# EAGLE board GD32F450 (EAGLE 9.6.2)
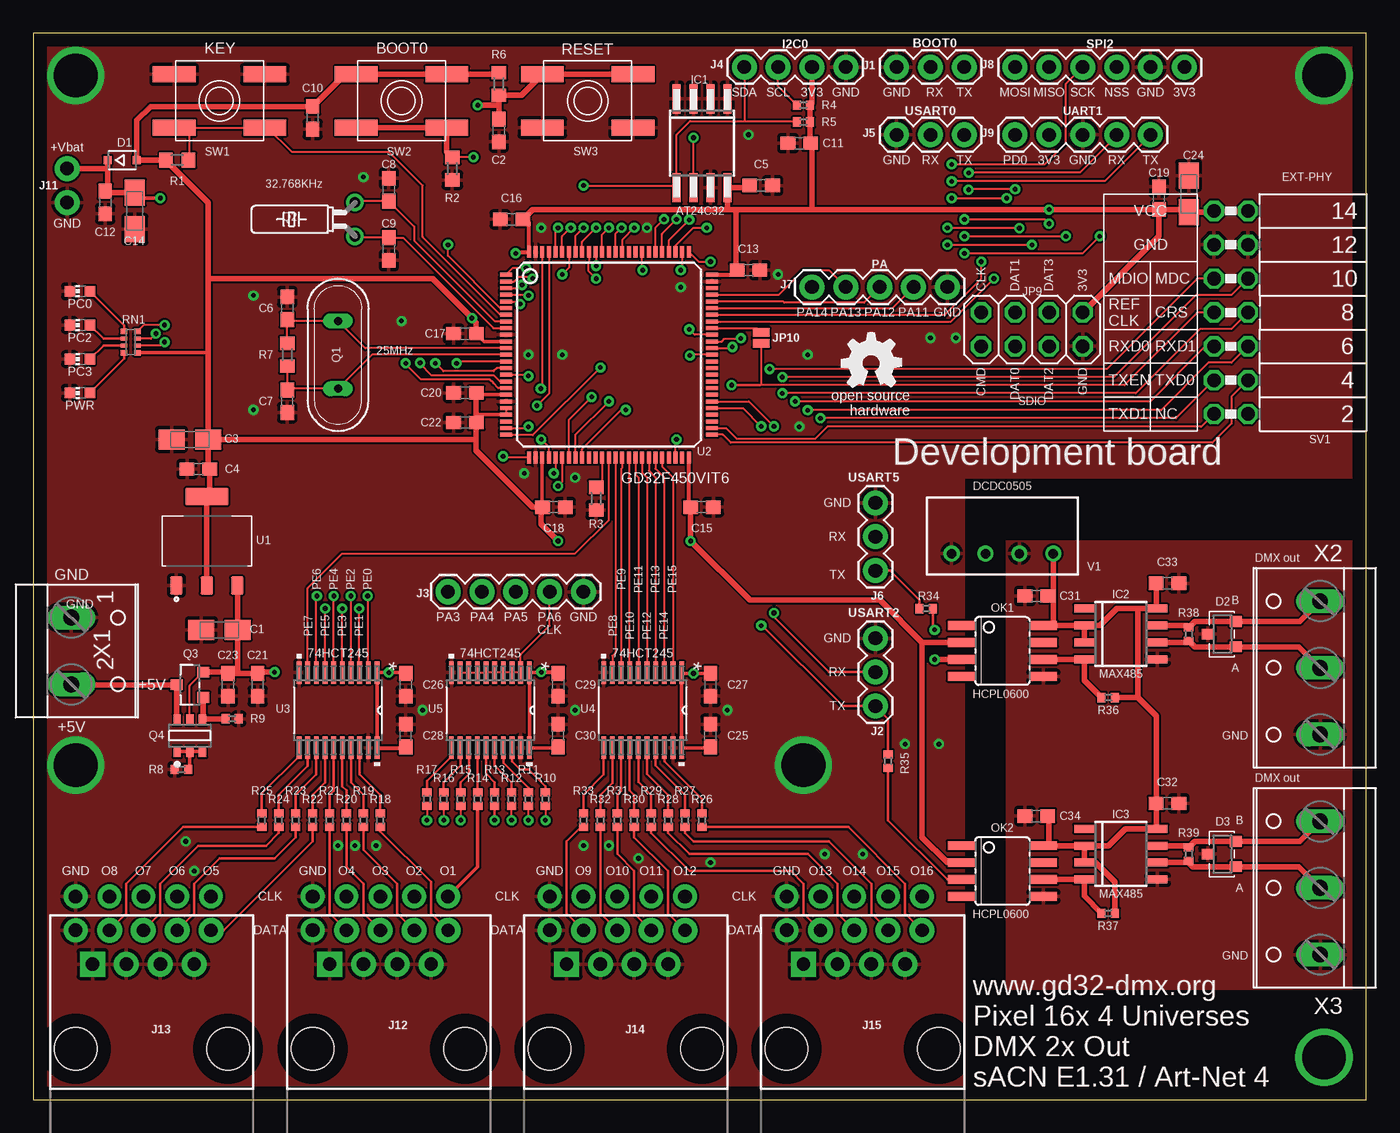
[diagram p2: board, top side]
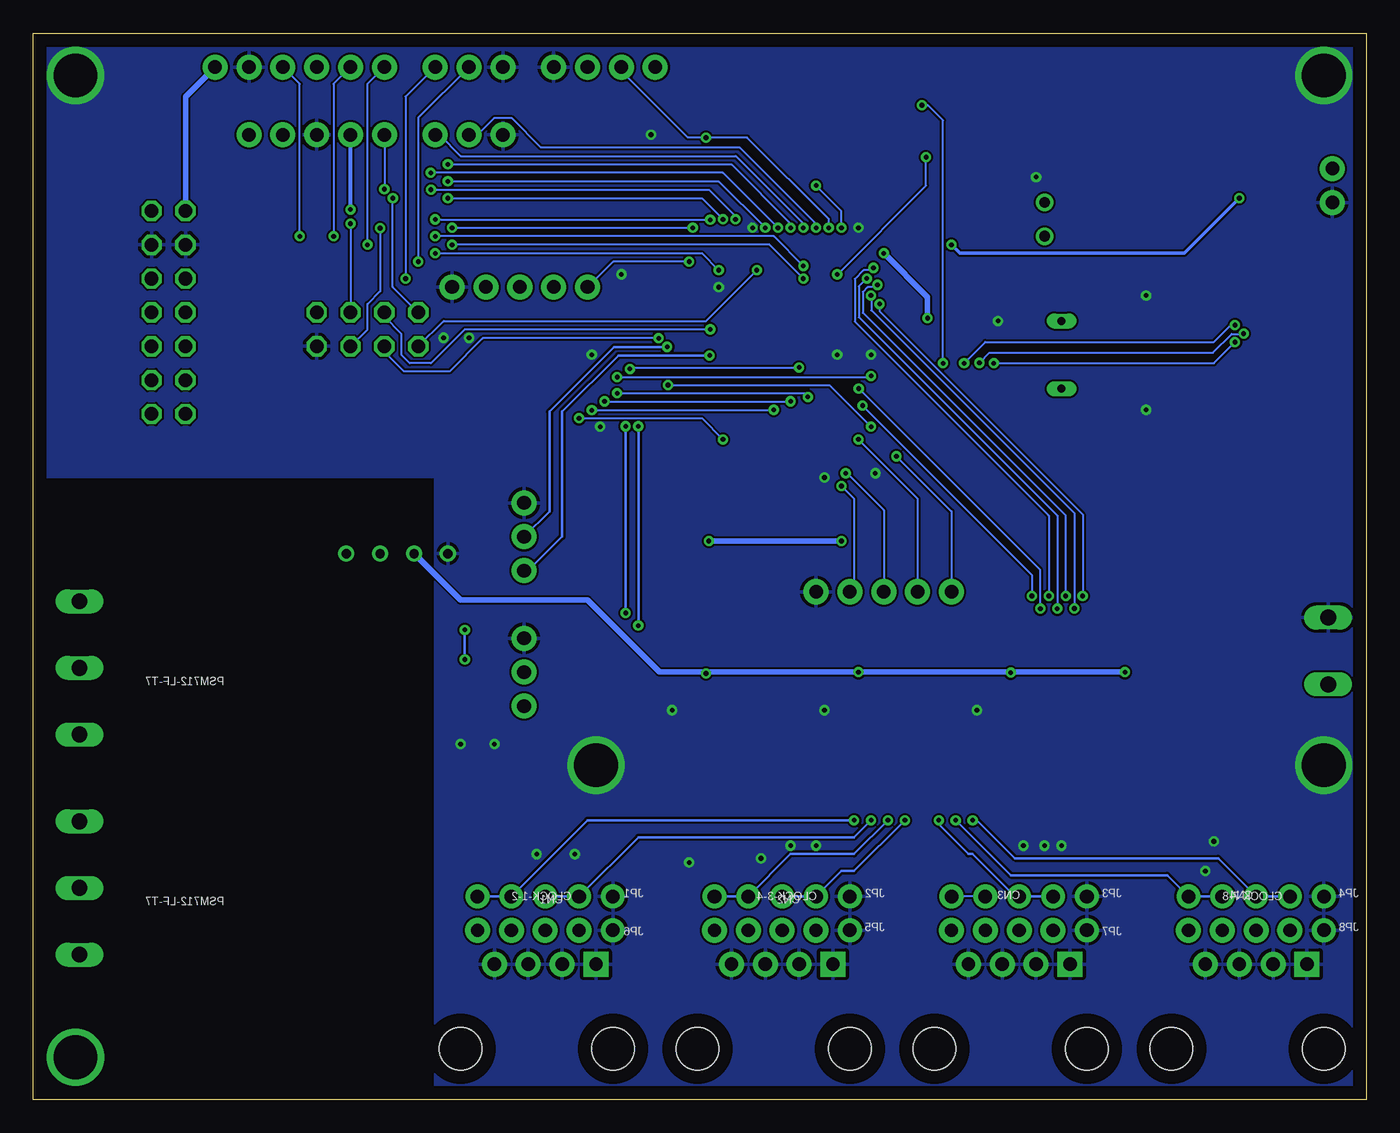
[diagram p3: board, bottom side, seen from below]

Size 100 x 80 mm. Coordinates in mm from the lower left corner, seen from the top.
Outline: 0,0 100,0 100,80 0,80 0,0
Copper layers (1*16): Top 0.035mm / dielectric 1.5mm / Bottom 0.035mm
Design rules "default": minimum track width 6mil, minimum drill 0.35mm, track to track 6mil, track to pad 6mil, pad to pad 6mil, via to via 6mil, smd to smd 6mil, copper to edge 40mil, drill to drill 6mil, minimum pad ring 10mil, minimum via ring 8mil, stop-mask expansion 4mil, vias tented up to drill 0mil, thermal gap 10mil

## Footprints (pad centres in the part's own frame; a part is rotated, then mirrored left to right if it is on the bottom)
A/3216-18R = smd 1.95 x 1.5: + 1.375,0; - -1.375,0
C0603 = smd 1.1 x 1: 1 -0.85,0; 2 0.85,0
1X04-CLEANBIG = drill 1.016 pad 1.778: 1 -3.81,0; 2 -1.27,0; 3 1.27,0; 4 3.81,0
SOD323-R = smd 0.6 x 0.6: A 1.1,0; C -1.1,0
SOT23-3 = smd 0.8 x 0.9: 1 -0.95,-1; 2 0.95,-1; 3 0,1.1
SO-08M = smd 0.6 x 2.2: 1 -1.905,-3.33; 2 -0.635,-3.33; 3 0.635,-3.33; 4 1.905,-3.33; 5 1.905,3.33; 6 0.635,3.33; 7 -0.635,3.33; 8 -1.905,3.33
D_R-PDSO-G8 = smd 0.6 x 1.5: 1 -1.905,-2.75; 2 -0.635,-2.75; 3 0.635,-2.75; 4 1.905,-2.75; 5 1.905,2.75; 6 0.635,2.75; 7 -0.635,2.75; 8 -1.905,2.75
1X03 = drill 1.016 pad 1.88: 1 0,0; 2 2.54,0; 3 5.08,0
1X05 = drill 1.016 pad 1.88: 1 0,0; 2 2.54,0; 3 5.08,0; 4 7.62,0; 5 10.16,0
1X04 = drill 1.016 pad 1.88: 1 0,0; 2 2.54,0; 3 5.08,0; 4 7.62,0
1X06 = drill 1.016 pad 1.88: 1 0,0; 2 2.54,0; 3 5.08,0; 4 7.62,0; 5 10.16,0; 6 12.7,0
1X02_NO_SILK = drill 1.016 pad 1.88: 1 0,0; 2 2.54,0
RJ45-8 = drill 1 pad 1.88 square: 1 -4.445,6.35 | drill 1 pad 1.88: 2 -3.175,8.89; 3 -1.905,6.35; 4 -0.635,8.89; 5 0.635,6.35; 6 1.905,8.89; 7 3.175,6.35; 8 4.445,8.89 | hole 3.2: -5.715,0; 5.715,0
1X01-CLEANBIG = drill 1.016 pad 1.778: 1 0,0
2X04 = drill 1.016 octagon: 1 -3.81,-1.27; 2 -3.81,1.27; 3 -1.27,-1.27; 4 -1.27,1.27; 5 1.27,-1.27; 6 1.27,1.27; 7 3.81,-1.27; 8 3.81,1.27
SMT-JUMPER_2_NO_NO-SILK = smd 0.635 x 1.27: 1 -0.406,0; 2 0.406,0
CHIP-LED0603 = smd 0.8 x 0.8: A 0,-0.75; C 0,0.75
SOIC08 = smd 0.66 x 2.032: 1 -1.905,-3.073; 2 -0.635,-3.073; 3 0.635,-3.073; 4 1.905,-3.073; 5 1.905,3.073; 6 0.635,3.073; 7 -0.635,3.073; 8 -1.905,3.073
QS = drill 0.61 long: 1 -2.54,0; 2 2.54,0
TC26H = drill 0.813: 1 -1.27,0; 2 1.27,0
DIODES_INC._DMG2305UX-13_0 = smd 0.9 x 0.8: 1 -1,0.95; 2 -1,-0.95; 3 1,0
DIODES_DMMT5401-7-F_0 = smd 0.8 x 0.55: 1 -1.2,0.95; 2 -1.2,0; 3 -1.2,-0.95; 4 1.2,-0.95; 5 1.2,0; 6 1.2,0.95
R0603 = smd 1 x 1.1: 1 -0.85,0; 2 0.85,0
R0402 = smd 0.6 x 0.7: 1 -0.5,0; 2 0.5,0
4X0402ARV341 = smd 0.4 x 0.5: 1 -0.8,-0.5; 4 0.8,-0.5; 5 0.8,0.5; 8 -0.8,0.5 | smd 0.3 x 0.5: 2 -0.25,-0.5; 3 0.25,-0.5; 6 0.25,0.5; 7 -0.25,0.5
FE07-2W = drill 1.016 octagon: 1 -7.62,1.27; 2 -7.62,-1.27; 3 -5.08,1.27; 4 -5.08,-1.27; 5 -2.54,1.27; 6 -2.54,-1.27; 7 0,1.27; 8 0,-1.27; 9 2.54,1.27; 10 2.54,-1.27; 11 5.08,1.27; 12 5.08,-1.27; 13 7.62,1.27; 14 7.62,-1.27
EVQ-Q2 = smd 3.2 x 1.2: A -3.4,-2; A' 3.4,-2; B -3.4,2; B' 3.4,2
SOT229P700X180-4N = smd 0.93 x 1.31: 1 -2.29,-3.345; 2 0,-3.345; 3 2.29,-3.345 | smd 3.24 x 1.31: 4 0,3.345
LQFP100 = smd 0.9 x 0.3: 1 -7.72,6; 2 -7.72,5.5; 3 -7.72,5; 4 -7.72,4.5; 5 -7.72,4; 6 -7.72,3.5; 7 -7.72,3; 8 -7.72,2.5; 9 -7.72,2; 10 -7.72,1.5; 11 -7.72,1; 12 -7.72,0.5; 13 -7.72,0; 14 -7.72,-0.5; 15 -7.72,-1; 16 -7.72,-1.5; 17 -7.72,-2; 18 -7.72,-2.5; 19 -7.72,-3; 20 -7.72,-3.5; 21 -7.72,-4; 22 -7.72,-4.5; 23 -7.72,-5; 24 -7.72,-5.5; 25 -7.72,-6; 51 7.72,-6; 52 7.72,-5.5; 53 7.72,-5; 54 7.72,-4.5; 55 7.72,-4; 56 7.72,-3.5; 57 7.72,-3; 58 7.72,-2.5; 59 7.72,-2; 60 7.72,-1.5; 61 7.72,-1; 62 7.72,-0.5; 63 7.72,0; 64 7.72,0.5; 65 7.72,1; 66 7.72,1.5; 67 7.72,2; 68 7.72,2.5; 69 7.72,3; 70 7.72,3.5; 71 7.72,4; 72 7.72,4.5; 73 7.72,5; 74 7.72,5.5; 75 7.72,6 | smd 0.3 x 0.9: 26 -6,-7.72; 27 -5.5,-7.72; 28 -5,-7.72; 29 -4.5,-7.72; 30 -4,-7.72; 31 -3.5,-7.72; 32 -3,-7.72; 33 -2.5,-7.72; 34 -2,-7.72; 35 -1.5,-7.72; 36 -1,-7.72; 37 -0.5,-7.72; 38 0,-7.72; 39 0.5,-7.72; 40 1,-7.72; 41 1.5,-7.72; 42 2,-7.72; 43 2.5,-7.72; 44 3,-7.72; 45 3.5,-7.72; 46 4,-7.72; 47 4.5,-7.72; 48 5,-7.72; 49 5.5,-7.72; 50 6,-7.72; 76 6,7.72; 77 5.5,7.72; 78 5,7.72; 79 4.5,7.72; 80 4,7.72; 81 3.5,7.72; 82 3,7.72; 83 2.5,7.72; 84 2,7.72; 85 1.5,7.72; 86 1,7.72; 87 0.5,7.72; 88 0,7.72; 89 -0.5,7.72; 90 -1,7.72; 91 -1.5,7.72; 92 -2,7.72; 93 -2.5,7.72; 94 -3,7.72; 95 -3.5,7.72; 96 -4,7.72; 97 -4.5,7.72; 98 -5,7.72; 99 -5.5,7.72; 100 -6,7.72
PW20 = smd 1.676 x 0.356: 1 -2.819,2.925; 2 -2.819,2.275; 3 -2.819,1.625; 4 -2.819,0.975; 5 -2.819,0.325; 6 -2.819,-0.325; 7 -2.819,-0.975; 8 -2.819,-1.625; 9 -2.819,-2.275; 10 -2.819,-2.925; 11 2.819,-2.925; 12 2.819,-2.275; 13 2.819,-1.625; 14 2.819,-0.975; 15 2.819,-0.325; 16 2.819,0.325; 17 2.819,0.975; 18 2.819,1.625; 19 2.819,2.275; 20 2.819,2.925
TME = drill 0.7 pad 1.1: 1 -3.81,0; 2 -1.27,0; 3 1.27,0; 4 3.81,0
W237-102 = drill 1.194 long: 1 -2.5,-1.27; 2 2.5,-1.27
W237-103 = drill 1.194 long: 1 -5,-1.29; 2 0,-1.29; 3 5,-1.29

## Placement (x,y rotation side)
C1  10uF  [A/3216-18R]  13.97,35.24 0 top
C2  100n  [C0603]  34.92,72.71 270 top
C3  10uF  [A/3216-18R]  11.75,49.53 0 top
C4  100n  [C0603]  12.38,47.31 180 top
C5  100n  [C0603]  54.61,68.58 0 top
C6  20pF  [C0603]  19.05,59.37 270 top
C7  20pF  [C0603]  19.05,52.39 90 top
C8  10pF  [C0603]  26.67,68.26 270 top
C9  10pF  [C0603]  26.67,63.82 90 top
C10  100n  [C0603]  20.95,73.66 270 top
C11  100n  [C0603]  57.47,71.75 180 top
C12  100n  [C0603]  5.4,67.31 270 top
C13  100n  [C0603]  53.66,62.23 0 top
C14  10uF  [A/3216-18R]  7.62,66.67 90 top
C15  100n  [C0603]  50.16,44.45 0 top
C16  100n  [C0603]  35.88,66.04 180 top
C17  100n  [C0603]  32.38,57.47 180 top
C18  100n  [C0603]  39.05,44.45 0 top
C19  100n  [C0603]  84.45,67.63 90 top
C20  100n  [C0603]  32.38,53.02 180 top
C21  100n  [C0603]  16.83,31.11 270 top
C22  100n  [C0603]  32.38,50.8 180 top
C23  100n  [C0603]  14.61,31.11 270 top
C24  10uF  [A/3216-18R]  86.68,67.94 270 top
C25  100n  [C0603]  50.8,27.3 90 top
C26  100n  [C0603]  27.94,31.11 270 top
C27  100n  [C0603]  50.8,31.11 270 top
C28  100n  [C0603]  27.94,27.3 90 top
C29  100n  [C0603]  39.37,31.11 270 top
C30  100n  [C0603]  39.37,27.3 90 top
C31  100n  [C0603]  75.25,37.78 180 top
C32  100n  [C0603]  85.09,22.23 0 top
C33  100n  [C0603]  85.09,38.73 0 top
C34  100n  [C0603]  75.25,21.27 180 top
CN1  CLOCK-1-2  [1X04-CLEANBIG]  62.87,15.24 180 top
CN2  CLOCK-3-4  [1X04-CLEANBIG]  45.09,15.24 180 top
CN3  CLOCK-5-6  [1X04-CLEANBIG]  27.3,15.24 180 top
CN4  CLOCK-7-8  [1X04-CLEANBIG]  9.53,15.24 180 top
D1  1N5819  [SOD323-R]  6.67,70.48 0 top
D2  PSM712-LF-T7  [SOT23-3]  89.22,34.92 90 top
D3  PSM712-LF-T7  [SOT23-3]  89.22,18.41 90 top
GOLD_ORB_SM1  OSHWLOGOLOGO5MM  [OSHW_5MM]  62.87,55.24 0 top
IC1  AT24C32  [SO-08M]  50.16,71.75 180 top
IC2  MAX485  [D_R-PDSO-G8]  81.6,34.92 270 top
IC3  MAX485  [D_R-PDSO-G8]  81.6,18.41 270 top
J1  BOOT0  [1X03]  64.77,77.47 0 top
J2  USART2  [1X03]  63.18,34.61 270 top
J3  PA  [1X05]  41.27,38.1 180 top
J4  I2C0  [1X04]  60.96,77.47 180 top
J5  USART0  [1X03]  64.77,72.39 0 top
J6  USART5  [1X03]  63.18,44.77 270 top
J7  PA  [1X05]  68.58,60.96 180 top
J8  SPI2  [1X06]  86.36,77.47 180 top
J9  UART1  [1X05]  73.66,72.39 0 top
J11  Vbat  [1X02_NO_SILK]  2.54,67.31 90 top
J12  RJ45  [RJ45-8]  26.67,3.81 0 top
J13  RJ45  [RJ45-8]  8.89,3.81 0 top
J14  RJ45  [RJ45-8]  44.45,3.81 0 top
J15  RJ45  [RJ45-8]  62.23,3.81 0 top
JP1  GND  [1X01-CLEANBIG]  56.52,15.24 0 top
JP2  GND  [1X01-CLEANBIG]  38.73,15.24 0 top
JP3  GND  [1X01-CLEANBIG]  20.95,15.24 0 top
JP4  GND  [1X01-CLEANBIG]  3.17,15.24 0 top
JP5  GND  [1X01-CLEANBIG]  38.73,12.7 0 top
JP6  GND  [1X01-CLEANBIG]  56.52,12.7 0 top
JP7  GND  [1X01-CLEANBIG]  20.95,12.7 0 top
JP8  GND  [1X01-CLEANBIG]  3.17,12.7 0 top
JP9  SDIO  [2X04]  74.93,57.78 0 top
JP10  RMII_REF_CLK  [SMT-JUMPER_2_NO_NO-SILK]  54.61,57.15 270 top
LED1  PC0  [CHIP-LED0603]  3.49,60.64 90 top
LED2  PC2  [CHIP-LED0603]  3.49,58.1 90 top
LED3  PC3  [CHIP-LED0603]  3.49,55.56 90 top
LED4  PWR  [CHIP-LED0603]  3.49,53.02 90 top
OK1  HCPL0600  [SOIC08]  72.71,33.66 270 top
OK2  HCPL0600  [SOIC08]  72.71,17.14 270 top
Q1  25MHz  [QS]  22.86,55.88 90 top
Q2  32.768KHz  [TC26H]  24.13,66.04 90 top
Q3  DMG2305UX  [DIODES_INC._DMG2305UX-13_0]  11.75,31.11 180 top
Q4  DMMT5401  [DIODES_DMMT5401-7-F_0]  11.75,27.3 90 top
R1  10K  [R0603]  10.79,70.48 180 top
R2  10K  [R0603]  31.43,69.85 90 top
R3  10K  [R0603]  42.23,45.09 270 top
R4  4K7  [R0402]  57.78,74.61 0 top
R5  4K7  [R0402]  57.78,73.34 0 top
R6  10K  [R0603]  34.92,76.2 90 top
R7  1M  [R0603]  19.05,55.88 90 top
R8  10K  [R0402]  11.11,24.77 0 top
R9  47K  [R0402]  14.92,28.57 180 top
R10  100  [R0402]  38.42,22.54 270 top
R11  100  [R0402]  37.15,22.54 270 top
R12  100  [R0402]  35.88,22.54 270 top
R13  100  [R0402]  34.61,22.54 270 top
R14  100  [R0402]  33.34,22.54 270 top
R15  100  [R0402]  32.07,22.54 270 top
R16  100  [R0402]  30.8,22.54 270 top
R17  100  [R0402]  29.53,22.54 270 top
R18  100  [R0402]  26.04,20.95 270 top
R19  100  [R0402]  24.77,20.95 270 top
R20  100  [R0402]  23.5,20.95 270 top
R21  100  [R0402]  22.23,20.95 270 top
R22  100  [R0402]  20.95,20.95 270 top
R23  100  [R0402]  19.68,20.95 270 top
R24  100  [R0402]  18.41,20.95 270 top
R25  100  [R0402]  17.14,20.95 270 top
R26  100  [R0402]  50.16,20.95 270 top
R27  100  [R0402]  48.9,20.95 270 top
R28  100  [R0402]  47.62,20.95 270 top
R29  100  [R0402]  46.35,20.95 270 top
R30  100  [R0402]  45.09,20.95 270 top
R31  100  [R0402]  43.81,20.95 270 top
R32  100  [R0402]  42.55,20.95 270 top
R33  100  [R0402]  41.27,20.95 270 top
R34  470  [R0402]  66.99,36.83 0 top
R35  470  [R0402]  64.14,25.4 270 top
R36  4K7  [R0402]  80.64,30.16 180 top
R37  4K7  [R0402]  80.64,13.97 180 top
R38  120  [R0402]  86.68,34.92 90 top
R39  120  [R0402]  86.68,18.41 90 top
RN1  2K  [4X0402ARV341]  7.3,56.83 270 top
SV1  EXT-PHY  [FE07-2W]  89.85,59.05 90 top
SW1  KEY  [EVQ-Q2]  13.97,74.93 180 top
SW2  BOOT0  [EVQ-Q2]  27.62,74.93 180 top
SW3  RESET  [EVQ-Q2]  41.59,74.93 0 top
U1  AMS1117-3.3  [SOT229P700X180-4N]  13.02,41.91 0 top
U2  GD32F450VIT6  [LQFP100]  43.18,55.88 0 top
U3  74HCT245  [PW20]  22.86,29.21 270 top
U4  74HCT245  [PW20]  45.72,29.21 270 top
U5  74HCT245  [PW20]  34.29,29.21 270 top
V1  DCDC0505  [TME]  72.71,40.96 0 top
X1  +5V  [W237-102]  4.13,33.66 270 top
X2  DMX Out  [W237-103]  95.25,32.38 90 top
X3  DMX Out  [W237-103]  95.25,15.88 90 top

## Tracks (layer width: path | path; a pad name or v marks a point on that pad's centre or on a via)
+3V3  (via drill 0.35)
  Top 0.152: C15.1 49.18,44.59 | U2.21 U2.22 | C13.1 52.81,61.88
  Top 0.254: U2.22 33.29,51.38 33.23,51.44 | U2.19 33.38,52.88 C20.1 | U2.28 38.18,44.47 C18.1 | U2.11 33.82,56.88 C17.1 | RN1.5 12.97,56.03 13.12,55.88
  Top 0.305: 49.18,44.59 U2.50 | U2.75 52.81,61.88 | 36.96,66.04 37.18,65.82 U2.100 36.3,63.6 v36.2,63.5
  Top 0.406: OK1.2 66.67,34.29 | C15.1 v49.31,41.91 53.76,37.47 63.5,37.47 66.67,34.29 | OK2.2 68.58,17.78 66.67,19.68 66.67,34.29 | R6.2 34.8,76.93 SW2.A SW2.A' 23.38,76.93 C10.1 8.79,74.51 7.77,73.49 D1.A R1.2 13.12,67.31 13.12,61.59 | 36.96,66.04 C16.1 37.47,66.78 52.07,66.78 | SV1.14 SV1.13 88.48,66.57 C24.+ 86.47,66.78 C19.1 | 58.42,66.78 52.7,66.78 | 52.7,66.78 52.07,66.78 | C13.1 52.7,62.33 52.7,66.78 | J4.2 58.42,74.75 R4.2 R5.2 58.28,71.79 C11.1 58.42,71.65 58.42,66.78 | C20.1 33.23,51.44 C22.1 33.23,49.53 | C19.1 v76.2,66.78 58.42,66.78 | 33.23,49.53 33.23,48.68 37.47,44.45 C18.1 38.2,44.66 38.1,44.55 38.1,43.18 v39.37,41.91 | C17.1 33.23,58.3 v32.91,58.63 29.94,61.59 13.12,61.59 | 52.07,66.78 IC1.8 53.6,68.42 C5.1 | U1.2 U1.4 13.23,45.47 C4.1 13.12,47.42 C3.+ | C3.+ 33.23,49.53 | C3.+ 13.12,55.88 13.12,61.59 | JP9.8 84.45,64.77 C19.1
  Bottom 0.305: v76.2,66.78 J9.2
  Bottom 0.406: v49.31,41.91 v39.37,41.91 | v32.91,58.63 32.91,60.21 v36.2,63.5 | J8.1 88.58,75.25 SV1.13
+5V  (via drill 0.35)
  Top 0.152: Q4.5 11.75,31.07 Q3.2
  Top 0.254: U4.1 | U4.1 U4.20 50.74,26.39 C25.1 | C30.1 39.31,26.39 U5.20 U5.1 | C27.1 v49.53,31.96 48.71,31.96 U4.1 | U3.1 | U3.20 U3.1 | U5.1 | U5.1 39.31,32.03 C29.1 39.27,32.07 v38.1,32.07 | C26.1 27.88,32.03 v26.67,32.03 U3.1
  Top 0.305: U3.20 27.88,26.39 C28.1
  Top 0.406: U1.3 15.35,38.53 C1.+ 15.35,32.07 15.24,31.96 | 15.24,31.96 C21.1 16.93,32.07 v18.1,32.07 | 15.24,31.96 C23.1 14.51,32.06 Q3.2
  Bottom 0.254: 49.53,32.07 v49.53,31.96
  Bottom 0.406: V1.2 67.94,37.47 58.42,37.47 53.02,32.07 49.53,32.07 v38.1,32.07 26.71,32.07 v26.67,32.03 26.63,32.07 v18.1,32.07
BOOT0  (via drill 0.35)
  Top 0.152: v33.02,70.7 R2.2 | U2.94 40.18,62.41 v39.69,61.91
  Top 0.406: SW2.B' SW2.B 31.02,71.11 R2.2
  Bottom 0.152: v39.69,61.91 33.02,68.58 v33.02,70.7
BOOT1
  Top 0.152: U2.37 42.68,46.39 R3.1
BOOT_RX  (via drill 0.35)
  Top 0.152: U2.69 68.41,58.88 71.12,61.59 v71.12,62.87
  Bottom 0.152: J1.2 71.12,73.66 v71.12,62.87
BOOT_TX  (via drill 0.35)
  Top 0.152: U2.68 68.86,58.38 v72.07,61.59
  Bottom 0.152: J1.3 72.07,75.25 v72.07,61.59
CLK1  (via drill 0.35)
  Top 0.152: R10.2 v38.42,20.95
  Bottom 0.203: CN1.1 CN1.2 58.42,20.95 v38.42,20.95
CLK2  (via drill 0.35)
  Top 0.152: v37.15,20.95 R11.2
  Bottom 0.203: CN1.3 CN1.4 54.61,19.68 38.42,19.68 v37.15,20.95
CLK3  (via drill 0.35)
  Top 0.152: v35.88,20.95 R12.2
  Bottom 0.203: CN2.1 CN2.2 43.18,18.41 38.42,18.41 v35.88,20.95
CLK4  (via drill 0.35)
  Top 0.203: v34.61,20.95 R13.2
  Bottom 0.203: CN2.3 CN2.4 39.37,17.14 38.42,17.14 v34.61,20.95
CLK5
  Top 0.254: R14.2 33.34,17.46 CN3.1
  Bottom 0.152: CN3.2 CN3.1
CLK6  (via drill 0.35)
  Top 0.152: R15.2 v32.07,20.95
  Bottom 0.203: CN3.4 CN3.3 26.35,15.24 29.53,18.41 29.84,18.41 32.07,20.64 v32.07,20.95
CLK7  (via drill 0.35)
  Top 0.152: R16.2 v30.8,20.95
  Bottom 0.203: CN4.2 CN4.1 14.92,16.83 26.67,16.83 v30.8,20.95
CLK8  (via drill 0.35)
  Top 0.152: R17.2 v29.53,20.95
  Bottom 0.203: CN4.4 CN4.3 11.11,18.1 26.35,18.1 29.21,20.95 v29.53,20.95
ENET_MDC  (via drill 0.35)
  Top 0.152: U2.16 37.06,54.38 v37.15,54.29 | SV1.10 89.89,60.36 87.22,60.36 81.06,54.21 v56.2,54.21
  Bottom 0.152: v56.2,54.21 37.23,54.21 v37.15,54.29
ENET_MDIO  (via drill 0.35)
  Top 0.152: v42.55,54.93 37.47,49.85 35.49,49.85 U2.25 | SV1.9 87.31,61.59 80.53,54.81 v55.24,54.81
  Bottom 0.152: v55.24,54.81 55.24,54.93 v42.55,54.93
GND  (via drill 0.35, 3.28)
  other vias: 37.15,55.88 39.69,55.88 67.94,26.67 65.41,26.67 52.07,29.21 29.21,29.21 38.1,65.41 27.62,58.42 3.17,76.83 96.84,76.83 3.17,25.08 57.78,25.08 40.64,46.67 36.83,46.99 53.66,72.39 55.88,61.91 48.58,60.96 46.04,65.41 16.51,60.33 16.51,51.75 24.77,69.22 40.64,29.21 11.43,19.37 25.72,19.05 45.4,18.1 59.37,18.41 50.8,17.78 62.23,18.41 12.06,17.14 24.13,19.05 22.86,19.05 41.27,19.05 43.18,19.05 58.1,55.88 57.47,50.48 69.22,57.15 67.31,57.15
  pour Top: -1.27,-1.27 69.85,-1.27 69.85,46.67 101.28,46.67 101.28,81.28 -1.27,81.28
  pour Bottom: -1.27,81.28 -1.27,-1.27 69.85,-1.27 69.85,46.67 101.28,46.67 101.28,81.28
GND-ISO
  pour Top: 100.01,8.26 73.03,8.26 73.03,41.91 100.01,41.91
I2C0_SCL  (via drill 0.35)
  Top 0.152: R4.1 55.88,76.02 J4.3 | IC1.6 v49.53,72.17 | U2.95 39.68,64.76 v40.32,65.41
  Bottom 0.152: 55.88,77.15 50.9,72.17 v49.53,72.17 46.45,72.17 40.32,66.04 v40.32,65.41
  Bottom 0.203: 55.88,77.15 J4.3
I2C0_SDA  (via drill 0.35)
  Top 0.152: R5.1 57.22,73.41 53.34,73.41 | IC1.5 48.26,68.58 | 48.26,68.58 48.26,72.39 49.28,73.41 53.34,73.41 | J4.4 53.34,73.41 | v41.27,68.58 48.26,68.58 | U2.96 39.18,65.22 v39.37,65.41
  Bottom 0.152: v39.37,65.41 39.37,66.67 v41.27,68.58
KEY
  Top 0.152: U2.7 35.04,58.88 29.21,64.71 29.21,68.58 26.67,71.12 19.37,71.12 17.56,72.93 SW1.B 11.75,72.93 | SW1.B' 11.75,72.93 | R1.1 11.75,70.59 11.75,72.93
N$1
  Top 0.203: U3.18 24.48,24.41 26.04,22.86 R18.1
N$2
  Top 0.254: Q4.1 Q4.2 | Q4.2 Q4.3 | Q4.2 11.75,24.9 R8.2
N$3
  Top 0.203: U3.17 23.84,23.79 24.77,22.86 R19.1
N$4
  Top 0.203: U3.16 23.18,23.49 23.5,23.18 R20.1
N$5
  Top 0.203: U3.15 22.54,23.17 22.23,22.86 R21.1
N$6
  Top 0.203: U3.14 21.89,23.79 20.95,22.86 R22.1
N$7
  Top 0.203: U3.13 21.23,24.41 19.68,22.86 R23.1
N$8
  Top 0.203: U3.12 20.59,25.03 18.41,22.86 R24.1
N$9
  Top 0.203: U3.11 19.93,25.76 17.14,22.97 R25.1
N$10
  Top 0.203: LED1.A 6.8,58.08 RN1.1
N$11
  Top 0.203: LED2.A 5.26,57.08 RN1.2
N$12
  Top 0.203: U4.18 47.34,25.36 50.16,22.54 R26.1
N$13
  Top 0.203: U4.17 46.7,25.06 48.9,22.86 R27.1
N$14
  Top 0.203: U4.16 46.05,24.44 47.62,22.86 R28.1
N$15
  Top 0.203: U4.15 45.4,23.82 46.35,22.86 R29.1
N$16
  Top 0.203: U4.14 44.74,23.2 45.09,22.86 R30.1
N$17
  Top 0.203: U4.13 44.09,23.14 43.81,22.86 R31.1
N$18
  Top 0.203: U4.12 43.45,23.76 42.55,22.86 R32.1
N$19
  Top 0.203: U4.11 42.8,24.38 41.27,22.86 R33.1
N$20
  Top 0.406: OK1.6 IC2.4 78.85,31.46 R36.2
N$21  (via drill 0.35)
  Top 0.152: 67.49,35.38 v67.63,35.24
  Top 0.203: R34.2 67.49,35.38
  Top 0.406: v67.63,33.02 OK1.3
  Bottom 0.203: v67.63,35.24 v67.63,33.02
N$22
  Top 0.406: OK2.6 IC3.4 78.85,15.27 R37.2
N$23
  Top 0.203: R35.2 64.14,20.95 68.58,16.51 OK2.3
N$24
  Top 0.152: 86.54,34.29 R38.1
  Top 0.406: R38.1 87.13,33.98 D2.1 94.95,33.98 X2.2 | IC2.6 86.54,34.29
N$25
  Top 0.203: LED3.A 5.26,56.58 RN1.3
N$26
  Top 0.203: RN1.4 6.8,55.58 LED4.A
N$27
  Top 0.152: 86.54,35.56 R38.2
  Top 0.406: R38.2 87.13,35.88 D2.2 95.03,35.88 X2.3 | IC2.7 86.54,35.56
N$28
  Top 0.152: 86.54,19.05 R39.2
  Top 0.406: IC3.7 86.54,19.05 | R39.2 87.13,19.36 D3.2 95.03,19.36 X3.3
N$29
  Top 0.152: 86.54,17.78 86.61,17.85 R39.1
  Top 0.406: IC3.6 86.54,17.78 | 86.61,17.85 86.99,17.46 D3.1 94.95,17.46 X3.2
N$30
  Top 0.406: Q3.1 12.75,28.55 Q4.4 12.77,28.57 R9.2
N$31
  Top 0.406: Q4.6 10.75,28.55 Q3.3 2.9,31.11 X1.2
N$32  (via drill 3.28)
  other vias: 96.84,3.17
N$33
  Top 0.203: U5.18 35.91,25.36 36.51,24.77 37.15,24.77 38.42,23.5 R10.1
N$34
  Top 0.203: R11.1 37.15,23.38 35.27,25.26 U5.17
N$35
  Top 0.152: U5.16
  Top 0.203: R12.1 35.88,23.81 34.61,25.08 U5.16
N$36
  Top 0.203: U5.15 33.97,24.45 34.61,23.81 R13.1
N$37
  Top 0.152: R14.1 33.31,23.07
  Top 0.203: 33.31,23.07 U5.14
N$38
  Top 0.152: 32.7,26.35 U5.13
  Top 0.203: 32.7,26.35 32.7,24.45 32.07,23.81 R15.1
N$39
  Top 0.152: 32.07,26.34 U5.12
  Top 0.203: R16.1 30.8,23.81 32.07,25.08 32.07,26.34
N$40
  Top 0.152: 31.36,25.76 U5.11
  Top 0.203: 31.36,25.76 29.53,23.92 R17.1
NRST  (via drill 0.35)
  Top 0.152: U2.14 31.89,55.38 v31.75,55.24
  Top 0.406: SW3.B' SW3.B 36.61,75.35 R6.1 34.92,74.61 | C2.1 34.92,74.61 | v33.34,74.61 34.92,74.61
  Bottom 0.152: v31.75,55.24 31.75,73.46 32.9,74.61 v33.34,74.61
O1
  Top 0.203: J12.8 29.84,13.97 29.84,16.33 26.04,20.14 R18.2
O2
  Top 0.203: J12.6 27.3,13.97 27.3,16.19 24.77,18.73 R19.2
O3
  Top 0.203: J12.4 24.77,13.97 24.77,16.19 23.5,17.46 R20.2
O4
  Top 0.203: J12.2 22.23,13.97 R21.2
O5
  Top 0.203: J13.8 14.29,12.7 20.95,19.37 R22.2
O6
  Top 0.203: J13.6 12.06,13.97 12.06,16.19 13.97,18.1 18.1,18.1 19.68,19.68 R23.2
O7
  Top 0.203: J13.4 9.53,13.97 9.53,16.19 12.38,19.05 17.46,19.05 18.41,20 R24.2
O8
  Top 0.203: J13.2 6.99,13.97 6.99,16.19 11.25,20.45 R25.2
O9
  Top 0.203: J14.2 40.01,13.97 40.01,19.37 41.09,20.45 R33.2
O10
  Top 0.203: J14.4 42.55,13.97 R32.2
O11
  Top 0.203: J14.6 45.09,13.97 45.09,17.14 43.81,18.41 R31.2
O12
  Top 0.203: J14.8 47.62,13.97 47.62,17.14 45.09,19.68 R30.2
O13
  Top 0.203: J15.2 57.78,13.97 57.78,16.19 56.83,17.14 49.21,17.14 46.35,20 R29.2
O14
  Top 0.203: J15.4 60.33,13.97 60.33,16.19 58.1,18.41 49.21,18.41 47.62,20 R28.2
O15
  Top 0.203: J15.6 62.87,13.97 62.87,16.19 59.69,19.37 49.53,19.37 48.9,20 R27.2
O16
  Top 0.203: R26.2 61.14,20.45 65.41,16.19 65.41,13.97 J15.8
OSC32_IN
  Top 0.152: Q2.2 24.23,67.41 C8.2 28.57,65.51 28.57,64.45 34.65,58.38 U2.8
OSC32_OUT
  Top 0.152: Q2.1 24.23,64.67 C9.2 27.73,64.67 34.51,57.88 U2.9
OSC_IN
  Top 0.152: U2.12 24.9,56.38 Q1.2 19.15,58.42 19.1,58.47 | 19.1,58.47 C6.2 | R7.2 19.05,58.42 19.1,58.47
OSC_OUT
  Top 0.152: U2.13 25.4,55.88 Q1.1 19.05,53.34 | R7.1 19.05,53.34 | 19.05,53.34 C7.2
PA3  (via drill 0.35)
  Top 0.152: U2.26 35.34,48.16 v35.24,48.26
  Bottom 0.152: v35.24,48.26 31.11,44.13 J3.5
PA4  (via drill 0.35)
  Top 0.152: U2.29 38.68,48.95 v38.1,49.53
  Bottom 0.152: v38.1,49.53 33.66,45.09 J3.4
PA5  (via drill 0.35)
  Top 0.152: U2.30 39.18,47.12 v39.05,46.99
  Bottom 0.152: J3.3 36.2,44.23 38.96,46.99 v39.05,46.99
PA6  (via drill 0.35)
  Top 0.152: U2.31 39.68,46.35 v39.37,46.04 | J3.2 38.73,35.56 36.56,33.39 U5.2 U5.3 U5.4 U5.5 U5.6 U5.7 U5.8 U5.9
  Bottom 0.152: v39.37,46.04 38.42,45.09 38.42,38.42 J3.2
PA8
  Top 0.152: U2.67 54.29,57.88 JP10.1
PA11
  Top 0.152: U2.70 64.46,59.38 J7.2
PA12
  Top 0.152: U2.71 56.26,59.88 56.35,59.79 62.33,59.79 J7.3
PC0  (via drill 0.35)
  Top 0.152: U2.15 34.78,54.88 34.54,54.64 30.77,54.64 v30.16,55.24 | v9.84,58.1 8.27,58.1 RN1.8
  Bottom 0.152: v30.16,55.24 28.57,56.83 11.43,56.83 10.16,58.1 v9.84,58.1
PC2  (via drill 0.35)
  Top 0.152: v9.19,57.47 8.81,57.08 RN1.7 | U2.17 35.02,53.88 34.57,54.33 29.9,54.33 29.02,55.22 v29.02,55.27
  Bottom 0.152: v29.02,55.27 28.26,56.03 11.5,56.03 10.09,57.44 9.22,57.44 v9.19,57.47
PC3  (via drill 0.35)
  Top 0.152: v9.84,56.83 9.59,56.58 RN1.6 | U2.18 34.89,53.38 34.52,53.75 34.51,53.75 34.24,54.03 29.08,54.03 27.94,55.17 v27.94,55.24
  Bottom 0.152: v27.94,55.24 11.43,55.24 v9.84,56.83
PD0  (via drill 0.35)
  Top 0.152: U2.81 46.68,65.41 v47.32,66.04 | v73.66,68.3 70.21,68.3 v70.17,68.26
  Bottom 0.152: v47.32,66.04 47.32,66.28 49.3,68.26 v70.17,68.26 | J9.1 v73.66,68.3
PE0  (via drill 0.35)
  Top 0.152: U2.97 38.68,52.97 v37.78,52.07 | U3.2 25.14,37.73 v25.08,37.78
  Bottom 0.152: v37.78,52.07 25.08,39.37 v25.08,37.78
PE1  (via drill 0.35)
  Top 0.152: U2.98 38.18,53.45 v38.07,53.34 | U3.3 24.45,32.07 v24.45,36.83
  Bottom 0.152: v24.45,36.83 24.45,39.71 v38.07,53.34
PE2  (via drill 0.35)
  Top 0.152: U2.1 35.98,62.4 v36.98,62.4 | U3.4 23.84,37.76 v23.81,37.78
  Bottom 0.152: v36.98,62.4 37.16,62.22 37.72,62.22 38.37,61.56 38.37,58.37 23.81,43.81 v23.81,37.78
PE3  (via drill 0.35)
  Top 0.152: v37.47,61.61 37.36,61.61 37.23,61.73 36.41,61.73 36.06,61.38 U2.2 | U3.5 v23.18,36.82 v23.18,36.83
  Bottom 0.152: v37.47,61.61 37.49,61.61 38.07,61.03 38.07,58.7 23.18,43.81 v23.18,36.83
PE4  (via drill 0.35)
  Top 0.152: U2.3 36.42,60.88 v36.66,61.13 | U3.6 v22.54,37.77 v22.54,37.78
  Bottom 0.152: v36.66,61.13 36.85,60.94 37.41,60.94 37.76,60.58 37.76,59.03 22.54,43.81 v22.54,37.78
PE5  (via drill 0.35)
  Top 0.152: U2.4 37.11,60.38 v37.16,60.33 | U3.7 21.89,36.82 v21.9,36.84
  Bottom 0.152: v37.16,60.33 37.12,60.3 37.12,59.23 21.88,43.99 21.88,36.86 v21.9,36.84
PE6  (via drill 0.35)
  Top 0.152: U2.5 36.32,59.88 v36.51,59.69 | U3.8 21.23,37.74 v21.27,37.78
  Bottom 0.152: v36.51,59.69 36.51,59.15 21.27,43.91 v21.27,37.78
PE7
  Top 0.152: U3.9 20.59,38.37 23.18,40.96 40.64,40.96 43.18,43.5 U2.38
PE8
  Top 0.152: U2.39 43.68,33.52 43.45,33.28 U4.9
PE9
  Top 0.152: U4.8 44.09,47.31 44.18,47.39 U2.40
PE10
  Top 0.152: U4.7 44.74,46.67 44.68,46.74 U2.41
PE11
  Top 0.152: U4.6 45.4,46.67 45.18,46.89 U2.42
PE12
  Top 0.152: U4.5 46.05,46.67 45.68,47.04 U2.43
PE13
  Top 0.152: U4.4 46.7,46.67 46.18,47.19 U2.44
PE14
  Top 0.152: U4.3 47.34,46.67 46.68,47.34 U2.45
PE15
  Top 0.152: U4.2 47.99,46.67 47.18,47.49 U2.46
RMII_CRS_DV  (via drill 0.35)
  Top 0.152: U2.32 40.18,51.01 v41.9,52.72 | SV1.8 89.89,57.82 87.54,57.82 82.71,52.99 v56.2,52.99
  Bottom 0.152: v56.2,52.99 41.9,52.99 v41.9,52.72
RMII_REF_CLK  (via drill 0.35)
  Top 0.152: U2.24 37.05,50.38 v37.15,50.48 | SV1.7 87.31,59.05 81.86,53.6 v52.39,53.6 54.55,53.6 54.61,53.66 JP10.2
  Bottom 0.152: v52.39,53.6 40.27,53.6 v37.15,50.48
RMII_RXD0  (via drill 0.35)
  Top 0.152: SV1.5 87.95,56.52 83.82,52.39 v57.15,52.39 | U2.33 40.68,49.89 v43.18,52.39
  Bottom 0.152: v57.15,52.39 v43.18,52.39
RMII_RXD1  (via drill 0.35)
  Top 0.152: U2.34 41.18,48.8 44.13,51.75 v44.45,51.75 | SV1.6 89.89,55.28 88.17,55.28 84.61,51.72 v58.1,51.72
  Bottom 0.152: v58.1,51.72 44.48,51.72 v44.45,51.75
RMII_TX_EN  (via drill 0.35)
  Top 0.152: U2.48 48.18,49.45 v48.26,49.53 | SV1.3 85.72,51.12 v59.05,51.12
  Bottom 0.152: v59.05,51.12 49.85,51.12 v48.26,49.53
RMII_TXD0
  Top 0.152: U2.51 51.73,49.88 52.33,49.28 88.47,49.28 89.89,50.71 89.89,52.74 SV1.4
RMII_TXD1
  Top 0.152: U2.52 51.98,50.38 52.77,49.59 58.67,49.59 59.57,50.48 87.63,50.48 SV1.1
SDIO_CK  (via drill 0.35)
  Top 0.152: U2.80 47.18,64.96 v48.26,66.04 | v68.9,67.63 v73.03,67.63
  Bottom 0.152: JP9.2 73.03,60.96 v73.03,67.63 | v68.9,67.63 49.84,67.63 v48.26,66.04
SDIO_CMD  (via drill 0.35)
  Top 0.152: v45.72,62.23 45.68,62.27 U2.83
  Bottom 0.152: JP9.1 69.22,58.42 49.53,58.42 v45.72,62.23
SDIO_D0  (via drill 0.35)
  Top 0.152: U2.65 51.67,56.88 51.87,57.08 53.05,57.08 v53.08,57.12
  Bottom 0.152: v53.08,57.12 66.28,57.12 68.77,54.62 72.2,54.62 73.66,56.08 JP9.3
SDIO_D1  (via drill 0.35)
  Top 0.152: U2.66 49.62,57.38 v49.21,57.78
  Bottom 0.152: JP9.4 73.66,58.74 72.39,57.47 72.39,55.88 71.75,55.24 70.17,55.24 67.63,57.78 v49.21,57.78
SDIO_D2  (via drill 0.35)
  Top 0.152: v68.58,65.41 73.95,65.41 v73.98,65.38 | U2.78 48.18,64.06 49.53,65.41 v50.53,65.41
  Bottom 0.152: v73.98,65.38 73.98,60.64 74.93,59.69 74.93,57.78 JP9.5 | v68.58,65.41 v50.53,65.41
SDIO_D3  (via drill 0.35)
  Top 0.152: U2.79 47.68,64.48 v49.21,66.01 | v69.85,66.04 75.88,66.04 v76.2,65.72
  Bottom 0.152: v69.85,66.04 69.82,66.01 v49.21,66.01 | v76.2,65.72 JP9.6
SPI2_MISO  (via drill 0.35)
  Top 0.152: U2.90 42.23,63.55 v42.23,62.55 | v69.85,64.77 v77.47,64.77
  Bottom 0.152: v42.23,62.55 44.45,64.77 v69.85,64.77 | J8.5 77.47,76.2 v77.47,64.77
SPI2_MOSI  (via drill 0.35)
  Top 0.152: U2.91 41.68,62.86 41.62,62.8 41.62,62.2 v42.23,61.59 | v68.58,64.14 v74.93,64.14
  Bottom 0.152: v42.23,61.59 44.77,64.14 v68.58,64.14 | J8.6 74.93,76.2 v74.93,64.14
SPI2_NSS  (via drill 0.35)
  Top 0.152: U2.77 48.68,62.33 v48.58,62.23 | v69.85,63.5 78.74,63.5 v80.01,64.77
  Bottom 0.152: v69.85,63.5 49.85,63.5 v48.58,62.23 | v80.01,64.77 80.01,76.2 J8.3
SPI2_SCK  (via drill 0.35)
  Top 0.152: v68.9,70.17 75.88,70.17 77.47,71.75 77.47,76.2 J8.4 | U2.89 42.68,64.91 v43.18,65.41
  Bottom 0.152: v43.18,65.41 43.18,65.72 47.62,70.17 v68.9,70.17
SWCLK  (via drill 0.35)
  Top 0.152: U2.76 49.91,62.87 v50.8,62.87
  Bottom 0.152: v50.8,62.87 56.52,62.87 J7.5
SWDIO
  Top 0.152: U2.72 55.94,60.38 57.78,62.23 59.69,62.23 J7.4
USART0_RX  (via drill 0.35)
  Top 0.152: U2.93 40.68,64.81 v41.27,65.41
  Bottom 0.152: J5.2 66.67,72.39 65.41,73.66 64.14,73.66 61.91,71.44 46.99,71.44 41.27,65.72 v41.27,65.41
USART0_TX  (via drill 0.35)
  Top 0.152: U2.92 41.18,64.36 v42.23,65.41
  Bottom 0.152: v42.23,65.41 42.23,65.72 47.3,70.79 67.93,70.79 69.53,72.39 J5.3
USART1_RX  (via drill 0.35)
  Top 0.152: J9.4 81.28,72.33 78.5,69.55 70.19,69.55 v70.18,69.53 | U2.87 43.68,64.95 v44.13,65.41
  Bottom 0.152: v44.13,65.41 48.26,69.53 v70.18,69.53
USART1_TX  (via drill 0.35)
  Top 0.152: J9.5 83.82,72.33 80.41,68.91 v68.91,68.91 v68.9,68.9 | v45.09,65.41 44.18,64.5 U2.86
  Bottom 0.152: v68.9,68.9 48.58,68.9 v45.09,65.41
USART2_RX  (via drill 0.35)
  Top 0.152: U2.56 53.69,52.38 v55.56,50.51
  Top 0.203: v55.56,36.51 55.56,36.2 59.69,32.07 J2.2
  Bottom 0.203: v55.56,50.51 v55.56,36.51
USART2_TX  (via drill 0.35)
  Top 0.152: U2.55 53.24,51.88 v54.61,50.51 | v54.61,35.56 54.61,35.65
  Top 0.203: 54.61,35.65 60.74,29.53 J2.3 64.14,28.57 R35.1
  Bottom 0.203: v54.61,50.51 v54.61,35.56
USART5_RX  (via drill 0.35)
  Top 0.152: U2.64 52.35,56.38 v52.44,56.47
  Bottom 0.203: J6.2 61.28,44.13 61.28,51.61 56.41,56.47 v52.44,56.47
USART5_TX  (via drill 0.35)
  Top 0.152: U2.63 49.31,55.88 v49.26,55.83
  Top 0.203: R34.1 66.49,37.47 64.27,39.69 J6.3
  Bottom 0.203: J6.3 62.87,39.69 60.33,42.23 60.33,51.61 56.1,55.83 v49.26,55.83
VBAT  (via drill 0.35)
  Top 0.152: C12.1 5.4,68.26 | v31.11,64.14 31.11,63.3 35.04,59.38 U2.6
  Top 0.254: v9.53,67.63 8.04,67.63
  Top 0.406: C12.1 5.51,68.05 C14.+ 8.04,67.63 | D1.C 5.57,69.85 | 5.57,69.85 5.57,68.43 5.4,68.26 | J11.2 5.57,69.85
  Bottom 0.254: v31.11,64.14 30.48,63.5 13.65,63.5 v9.53,67.63
VCC
  Top 0.152: OK1.8 76.52,35.56
  Top 0.406: IC2.2 76.52,35.56 76.52,37.78 | IC2.2 IC2.3 | OK2.8 76.2,19.05 | 76.2,19.05 IC3.2 | IC3.2 IC3.3 79.69,17.78 81.14,16.33 R37.1 | IC2.2 80.01,35.56 81.28,36.83 82.87,36.83 | IC2.8 84.14,36.83 | 84.14,36.83 82.87,36.83 | IC3.2 80.64,19.05 81.92,20.32 IC3.8 84.24,20.43 C32.1 84.24,28.79 82.87,30.16 | 82.87,30.16 82.87,36.83 | R36.1 82.87,30.16 | C33.1 84.24,36.93 84.14,36.83 | V1.4 76.52,37.78 | C31.1 76.52,37.78 | C34.1 76.2,21.17 76.2,19.05

## Text on the board
tPlace: www.gd32-dmx.org / Pixel 16x 4 Universes / DMX 2x Out / sACN E1.31 / Art-Net 4
tNames: SDA | SCL | 3V3 | GND | GND | RX | TX | MOSI | MISO | SCK | NSS | GND | 3V3 | +Vbat | GND | RX | TX | PD0 | 3V3 | GND | RX | TX | VCC | GND | GND | MDIO | MDC | CLK | DAT1 | DAT3 | 3V3 | PA14 | PA13 | PA12 | PA11 | GND | REF / CLK | CRS | RXD0 | RXD1 | CMD | DAT0 | DAT2 | GND | TXEN | TXD0 | TXD1 | NC | Development board | GND | RX | DMX out | GND | PE6 | PE4 | PE2 | PE0 | PE9 | PE11 | PE13 | PE15 | TX | GND | B | PE7 | PE5 | PE3 | PE1 | PA3 | PA4 | PA5 | PA6 | GND | PE8 | PE10 | PE12 | PE14 | CLK | GND | RX | A | +5V | TX | +5V | GND | DMX out | B | GND | O8 | O7 | O6 | O5 | GND | O4 | O3 | O2 | O1 | GND | O9 | O10 | O11 | O12 | GND | O13 | O14 | O15 | O16 | A | CLK | CLK | CLK | DATA | DATA | DATA | GND